# EAGLE design hd6303-mb-ram-rom-x1 (EAGLE 9.2.2)

## Sheet 1 of 2
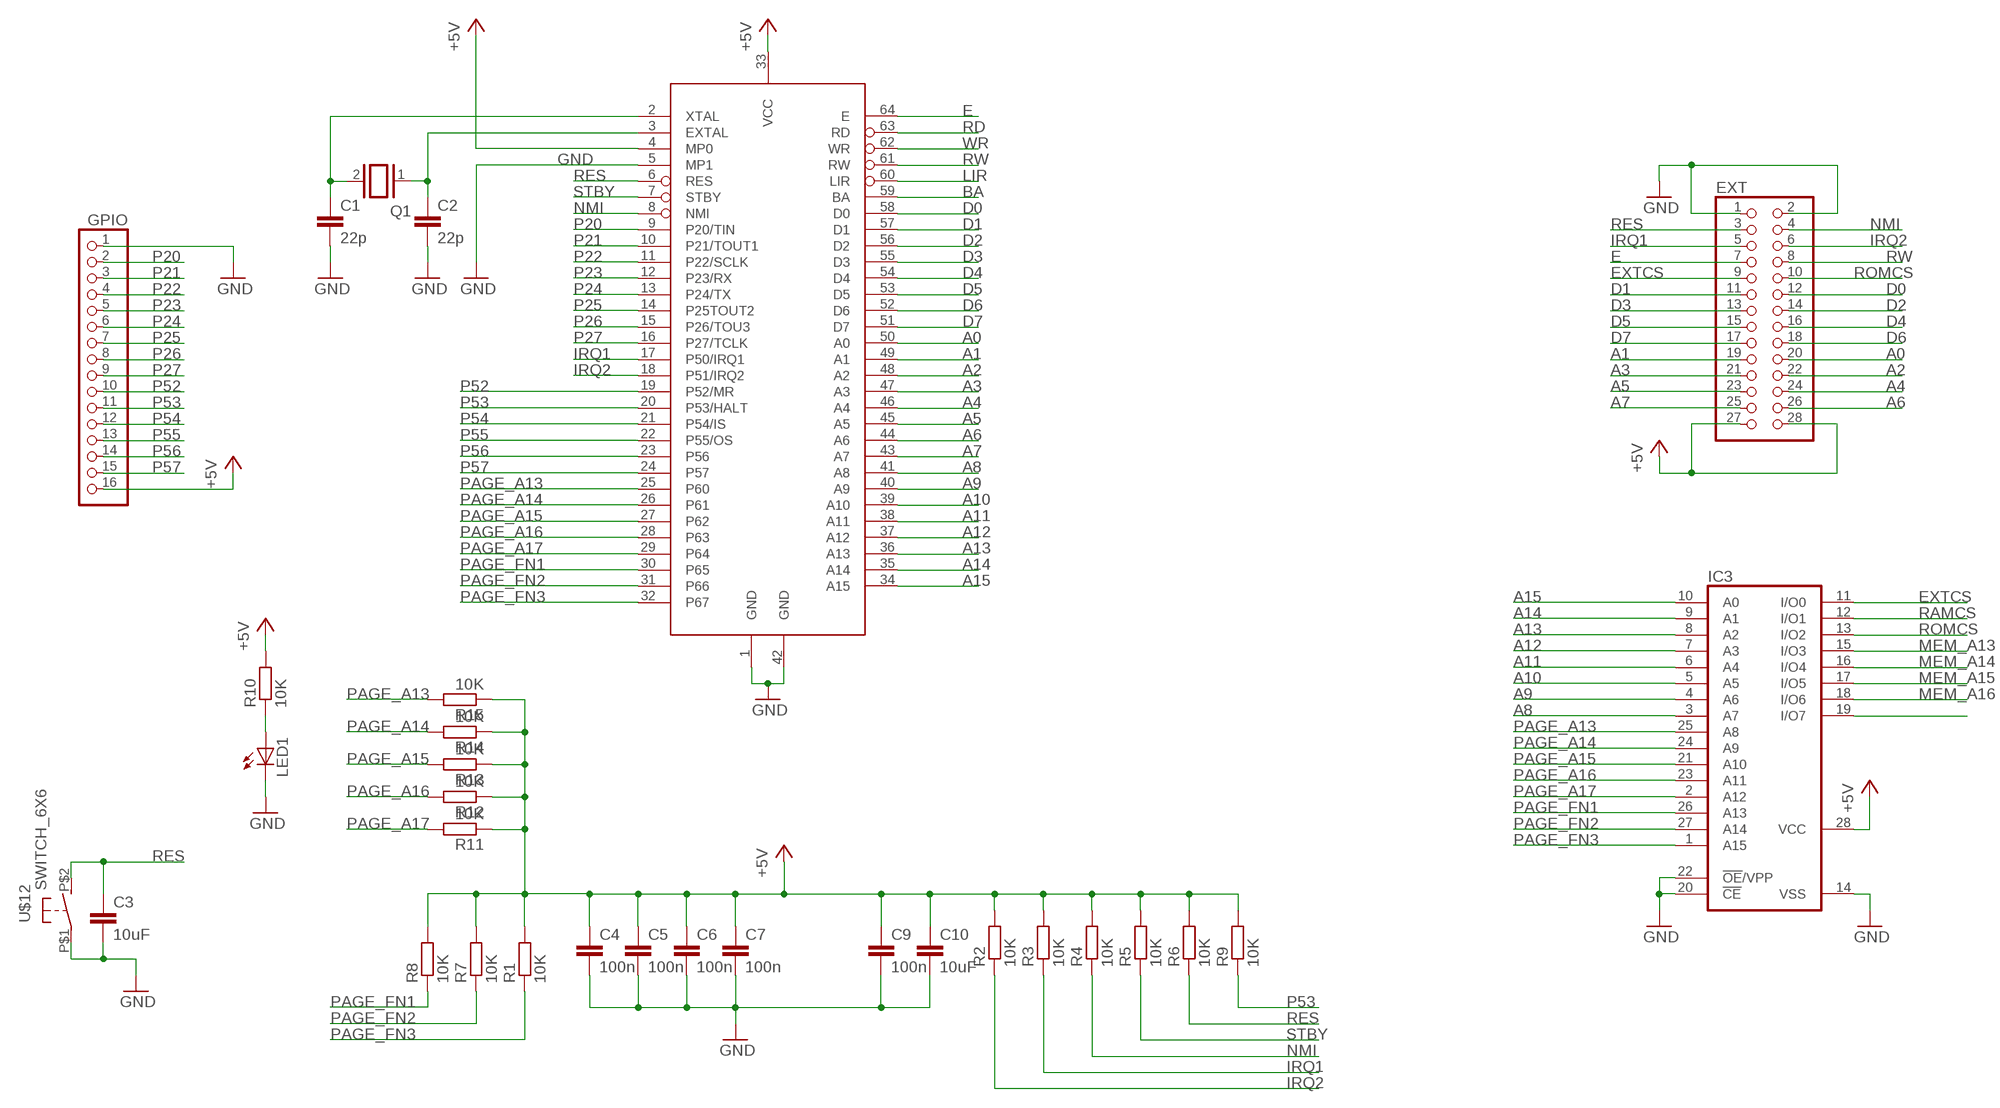
[diagram p0: schematic, sheet 1]

### Parts
C1  22p  C-EUC0603  [C0603]
C2  22p  C-EUC0603  [C0603]
C3  10uF  C-EUC0805  [C0805]
C4  100n  C-EUC0603  [C0603]
C5  100n  C-EUC0603  [C0603]
C6  100n  C-EUC0603  [C0603]
C7  100n  C-EUC0603  [C0603]
C9  100n  C-EUC0603  [C0603]
C10  10uF  C-EUC0805  [C0805]
EXT  PINHD-2X14  [2X14]
GPIO  PINHD-1X16  [1X16]
IC3  27512G  [DIL28-6]
LED1  LED5MM  [LED5MM]
Q1  XTAL/S  [QS]
R1  10K  R-EU_R0603  [R0603]
R2  10K  R-EU_R0603  [R0603]
R3  10K  R-EU_R0603  [R0603]
R4  10K  R-EU_R0603  [R0603]
R5  10K  R-EU_R0603  [R0603]
R6  10K  R-EU_R0603  [R0603]
R7  10K  R-EU_R0603  [R0603]
R8  10K  R-EU_R0603  [R0603]
R9  10K  R-EU_R0603  [R0603]
R10  10K  R-EU_R0603  [R0603]
R11  10K  R-EU_R0603  [R0603]
R12  10K  R-EU_R0603  [R0603]
R13  10K  R-EU_R0603  [R0603]
R14  10K  R-EU_R0603  [R0603]
R15  10K  R-EU_R0603  [R0603]
U$1  HD6303YCP  [DP-64S]
U$12  SWITCH_6X6  [SWITCH_6X6]

### Nets
+5V: C4.1 C5.1 C6.1 C7.1 C9.1 C10.1 EXT.27 EXT.28 GPIO.16 IC3.28(VCC) R1.2 R2.2 R3.2 R4.2 R5.2 R6.2 R7.2 R8.2 R9.2 R10.2 R11.1 R12.1 R13.1 R14.1 R15.1 U$1.4(MP0) U$1.33(VCC) ; also sheet 2
A0: EXT.20 U$1.50(A0) ; also sheet 2
A1: EXT.19 U$1.49(A1) ; also sheet 2
A2: EXT.22 U$1.48(A2) ; also sheet 2
A3: EXT.21 U$1.47(A3) ; also sheet 2
A4: EXT.24 U$1.46(A4) ; also sheet 2
A5: EXT.23 U$1.45(A5) ; also sheet 2
A6: EXT.26 U$1.44(A6) ; also sheet 2
A7: EXT.25 U$1.43(A7) ; also sheet 2
A8: IC3.3(A7) U$1.41(A8) ; also sheet 2
A9: IC3.4(A6) U$1.40(A9) ; also sheet 2
A10: IC3.5(A5) U$1.39(A10) ; also sheet 2
A11: IC3.6(A4) U$1.38(A11) ; also sheet 2
A12: IC3.7(A3) U$1.37(A12) ; also sheet 2
A13: IC3.8(A2) U$1.36(A13)
A14: IC3.9(A1) U$1.35(A14)
A15: IC3.10(A0) U$1.34(A15)
BA: U$1.59(BA)
D0: EXT.12 U$1.58(D0) ; also sheet 2
D1: EXT.11 U$1.57(D1) ; also sheet 2
D2: EXT.14 U$1.56(D2) ; also sheet 2
D3: EXT.13 U$1.55(D3) ; also sheet 2
D4: EXT.16 U$1.54(D4) ; also sheet 2
D5: EXT.15 U$1.53(D5) ; also sheet 2
D6: EXT.18 U$1.52(D6) ; also sheet 2
D7: EXT.17 U$1.51(D7) ; also sheet 2
E: EXT.7 U$1.64(E)
EXTCS: EXT.9 IC3.11(I/O0)
GND: C1.2 C2.2 C3.2 C4.2 C5.2 C6.2 C7.2 C9.2 C10.2 EXT.1 EXT.2 GPIO.1 IC3.14(VSS) IC3.20(!CE) IC3.22(!OE!/VPP) LED1.K(C) U$1.1(GND) U$1.5(MP1) U$1.42(GND) U$12.P$1(P) ; also sheet 2
IRQ1: EXT.5 R3.1 U$1.17(P50/IRQ1)
IRQ2: EXT.6 R2.1 U$1.18(P51/IRQ2)
LIR: U$1.60(LIR)
MEM_A13: IC3.15(I/O3) ; also sheet 2
MEM_A14: IC3.16(I/O4) ; also sheet 2
MEM_A15: IC3.17(I/O5) ; also sheet 2
MEM_A16: IC3.18(I/O6) ; also sheet 2
N$1: LED1.A R10.1
N$5: C1.1 Q1.2 U$1.2(XTAL)
N$25: IC3.19(I/O7)
N$30: C2.1 Q1.1 U$1.3(EXTAL)
NMI: EXT.4 R4.1 U$1.8(NMI)
P20: GPIO.2 U$1.9(P20/TIN)
P21: GPIO.3 U$1.10(P21/TOUT1)
P22: GPIO.4 U$1.11(P22/SCLK)
P23: GPIO.5 U$1.12(P23/RX)
P24: GPIO.6 U$1.13(P24/TX)
P25: GPIO.7 U$1.14(P25TOUT2)
P26: GPIO.8 U$1.15(P26/TOU3)
P27: GPIO.9 U$1.16(P27/TCLK)
P52: GPIO.10 U$1.19(P52/MR)
P53: GPIO.11 R9.1 U$1.20(P53/HALT)
P54: GPIO.12 U$1.21(P54/IS)
P55: GPIO.13 U$1.22(P55/OS)
P56: GPIO.14 U$1.23(P56)
P57: GPIO.15 U$1.24(P57)
PAGE_A13: IC3.25(A8) R15.2 U$1.25(P60)
PAGE_A14: IC3.24(A9) R14.2 U$1.26(P61)
PAGE_A15: IC3.21(A10) R13.2 U$1.27(P62)
PAGE_A16: IC3.23(A11) R12.2 U$1.28(P63)
PAGE_A17: IC3.2(A12) R11.2 U$1.29(P64)
PAGE_FN1: IC3.26(A13) R8.1 U$1.30(P65)
PAGE_FN2: IC3.27(A14) R7.1 U$1.31(P66)
PAGE_FN3: IC3.1(A15) R1.1 U$1.32(P67)
RAMCS: IC3.12(I/O1) ; also sheet 2
RD: U$1.63(RD) ; also sheet 2
RES: C3.1 EXT.3 R6.1 U$1.6(RES) U$12.P$2(S)
ROMCS: EXT.10 IC3.13(I/O2) ; also sheet 2
RW: EXT.8 U$1.61(RW)
STBY: R5.1 U$1.7(STBY)
WR: U$1.62(WR) ; also sheet 2

## Sheet 2 of 2
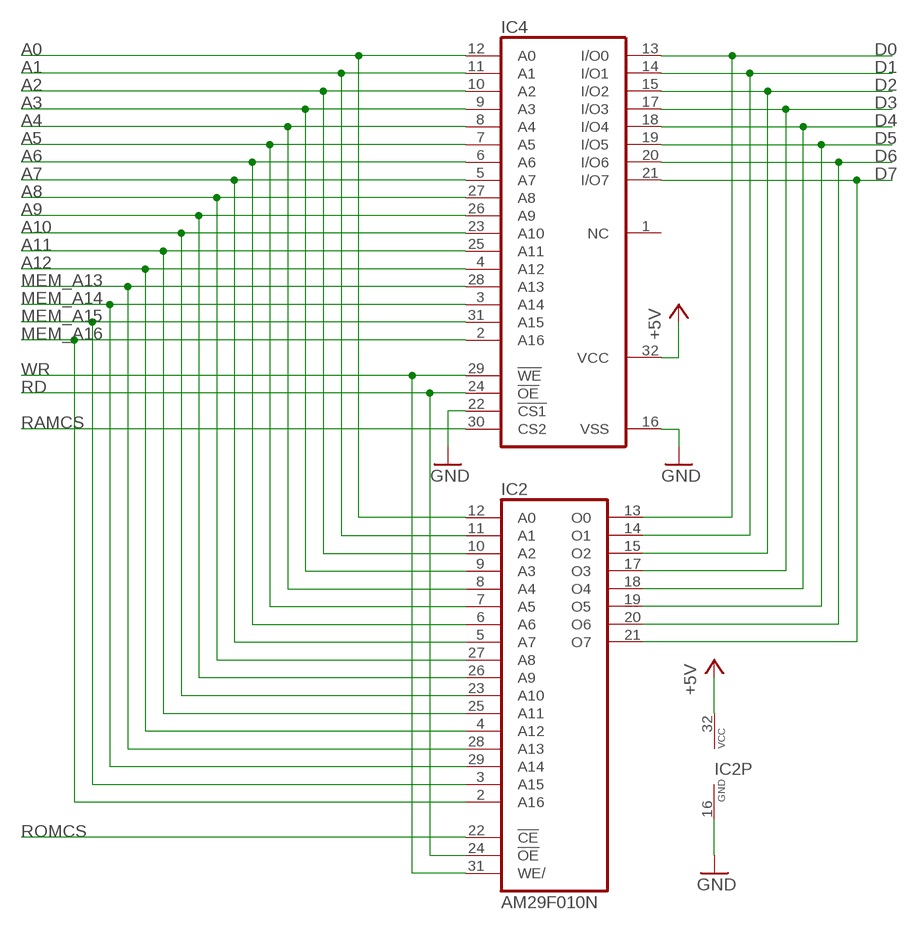
[diagram p1: schematic, sheet 2]

### Parts
IC2  AM29F010N  [DIP32]
IC4  628128P  [DIL32]

### Nets
+5V: IC2.32(VCC) IC4.32(VCC) ; also sheet 1
A0: IC2.12(A0) IC4.12(A0) ; also sheet 1
A1: IC2.11(A1) IC4.11(A1) ; also sheet 1
A2: IC2.10(A2) IC4.10(A2) ; also sheet 1
A3: IC2.9(A3) IC4.9(A3) ; also sheet 1
A4: IC2.8(A4) IC4.8(A4) ; also sheet 1
A5: IC2.7(A5) IC4.7(A5) ; also sheet 1
A6: IC2.6(A6) IC4.6(A6) ; also sheet 1
A7: IC2.5(A7) IC4.5(A7) ; also sheet 1
A8: IC2.27(A8) IC4.27(A8) ; also sheet 1
A9: IC2.26(A9) IC4.26(A9) ; also sheet 1
A10: IC2.23(A10) IC4.23(A10) ; also sheet 1
A11: IC2.25(A11) IC4.25(A11) ; also sheet 1
A12: IC2.4(A12) IC4.4(A12) ; also sheet 1
D0: IC2.13(O0) IC4.13(I/O0) ; also sheet 1
D1: IC2.14(O1) IC4.14(I/O1) ; also sheet 1
D2: IC2.15(O2) IC4.15(I/O2) ; also sheet 1
D3: IC2.17(O3) IC4.17(I/O3) ; also sheet 1
D4: IC2.18(O4) IC4.18(I/O4) ; also sheet 1
D5: IC2.19(O5) IC4.19(I/O5) ; also sheet 1
D6: IC2.20(O6) IC4.20(I/O6) ; also sheet 1
D7: IC2.21(O7) IC4.21(I/O7) ; also sheet 1
GND: IC2.16(GND) IC4.16(VSS) IC4.22(!CS1) ; also sheet 1
MEM_A13: IC2.28(A13) IC4.28(A13) ; also sheet 1
MEM_A14: IC2.29(A14) IC4.3(A14) ; also sheet 1
MEM_A15: IC2.3(A15) IC4.31(A15) ; also sheet 1
MEM_A16: IC2.2(A16) IC4.2(A16) ; also sheet 1
RAMCS: IC4.30(CS2) ; also sheet 1
RD: IC2.24(!OE) IC4.24(!OE) ; also sheet 1
ROMCS: IC2.22(!CE) ; also sheet 1
WR: IC2.31(WE/) IC4.29(!WE) ; also sheet 1
Unconnected: IC2.1(NC) IC2.30(NC) IC4.1(NC)

## Library data of the parts
C1 = rcl:C-EU: CAPACITOR, European symbol; SPICEPREFIX: C
C2 C4-C7 C9 = rcl:C-EU: CAPACITOR, European symbol
C3 C10 = resistor:C-EU: CAPACITOR, European symbol
EXT = pinhead:PINHD-2X14: PIN HEADER
GPIO = pinhead:PINHD-1X16: PIN HEADER
IC2 = am29-memory:AM29F010*: 1-Megabit FLASH MEMORY (128 K x 8 bit) 5 V-only
IC3 = memory-hitachi:27512G: MEMORY; OC_FARNELL: unknown; OC_NEWARK: unknown
IC4 = memory-hitachi:628128P: MEMORY; OC_FARNELL: unknown; OC_NEWARK: unknown
LED1 = led:LED: LED OSRAM: - CHIPLED LG R971, LG N971, LY N971, LG Q971, LY Q971, LO R971, LY R971 LH N974, LH R974 LS Q976, LO Q976, LY Q976 LO Q996 - Hyper CHIPLED LW Q18S LB Q993, LB Q99A, LB R99A - SideLED LS A670, LO A670, LY A670, LG A670, LP A670 LB A673, LV A673, LT A673, LW A673 LH A674 LY A675 LS A676, LA A676, LO A676, LY A676, LW A676 LS A679, LY A679, LG A679 - Hyper Micro SIDELED® LS Y876, LA Y876, LO Y876, LY Y876 LT Y87S - SmartLED LW L88C, LW L88S LB L89C, LB L89S, LG L890 LS L89K, LO L89K, LY L89K LS L896, LA L896, LO L896, LY L896 - TOPLED LS T670, LO T670, LY T670, LG T670, LP T670 LSG T670, LSP T670, LSY T670, LOP T670, LYG T670 LG T671, LOG T671, LSG T671 LB T673, LV T673, LT T673, LW T673 LH T674 LS T676, LA T676, LO T676, LY T676, LB T676, LH T676, LSB T676, LW T676 LB T67C, LV T67C, LT T67C, LS T67K, LO T67K, LY T67K, LW E67C LS E67B, LA E67B, LO E67B, LY E67B, LB E67C, LV E67C, LT E67C LW T67C LS T679, LY T679, LG T679 LS T770, LO T770, LY T770, LG T770, LP T770 LB T773, LV T773, LT T773, LW T773 LH T774 LS E675, LA E675, LY E675, LS T675 LS T776, LA T776, LO T776, LY T776, LB T776 LHGB T686 LT T68C, LB T68C - Hyper Mini TOPLED® LB M676 - Mini TOPLED Santana® LG M470 LS M47K, LO M47K, LY M47K Source: http://www.osram.convergy.de LUXEON: - LUMILED® LXK2-PW12-R00, LXK2-PW12-S00, LXK2-PW14-U00, LXK2-PW14-V00 LXK2-PM12-R00, LXK2-PM12-S00, LXK2-PM14-U00 LXK2-PE12-Q00, LXK2-PE12-R00, LXK2-PE12-S00, LXK2-PE14-T00, LXK2-PE14-U00 LXK2-PB12-K00, LXK2-PB12-L00, LXK2-PB12-M00, LXK2-PB14-N00, LXK2-PB14-P00, LXK2-PB14-Q00 LXK2-PR12-L00, LXK2-PR12-M00, LXK2-PR14-Q00, LXK2-PR14-R00 LXK2-PD12-Q00, LXK2-PD12-R00, LXK2-PD12-S00 LXK2-PH12-R00, LXK2-PH12-S00 LXK2-PL12-P00, LXK2-PL12-Q00, LXK2-PL12-R00 Source: www.luxeon.com KINGBRIGHT: KA-3528ASYC Source: www.kingbright.com
Q1 = special:XTAL/S: CRYSTAL
R1-R15 = resistor:R-EU_: RESISTOR, European symbol
U$1 = addons-lib:HD6303YCP
U$12 = mouse_enc:SWITCH_6X6

## Board
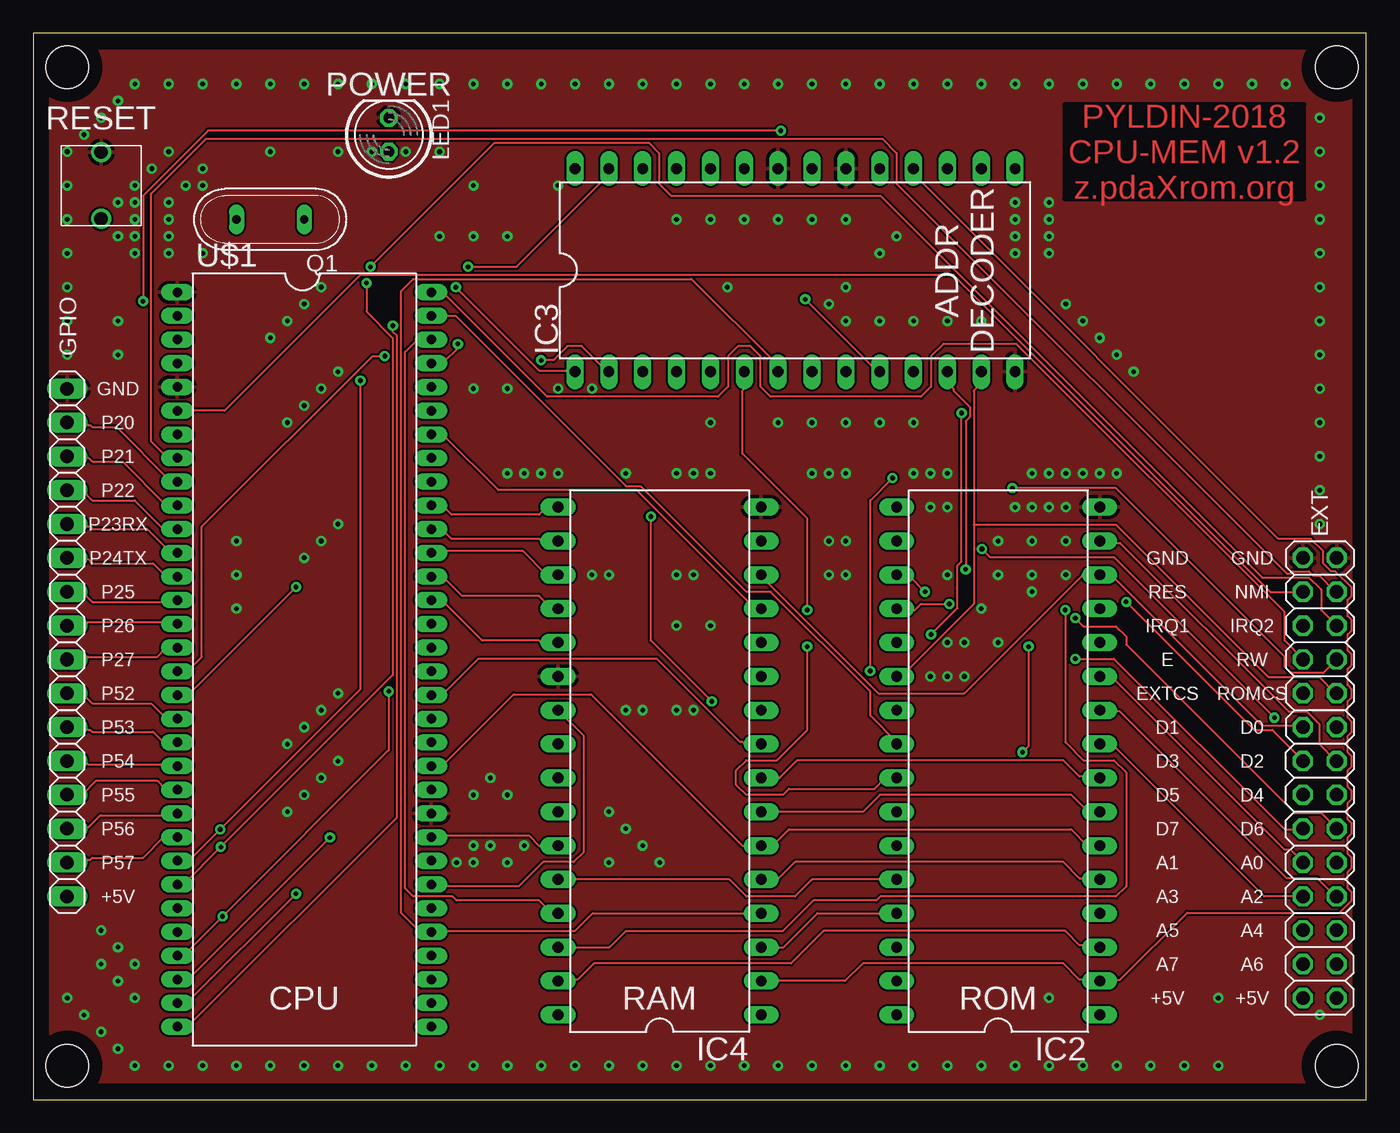
[diagram p2: board, top side]
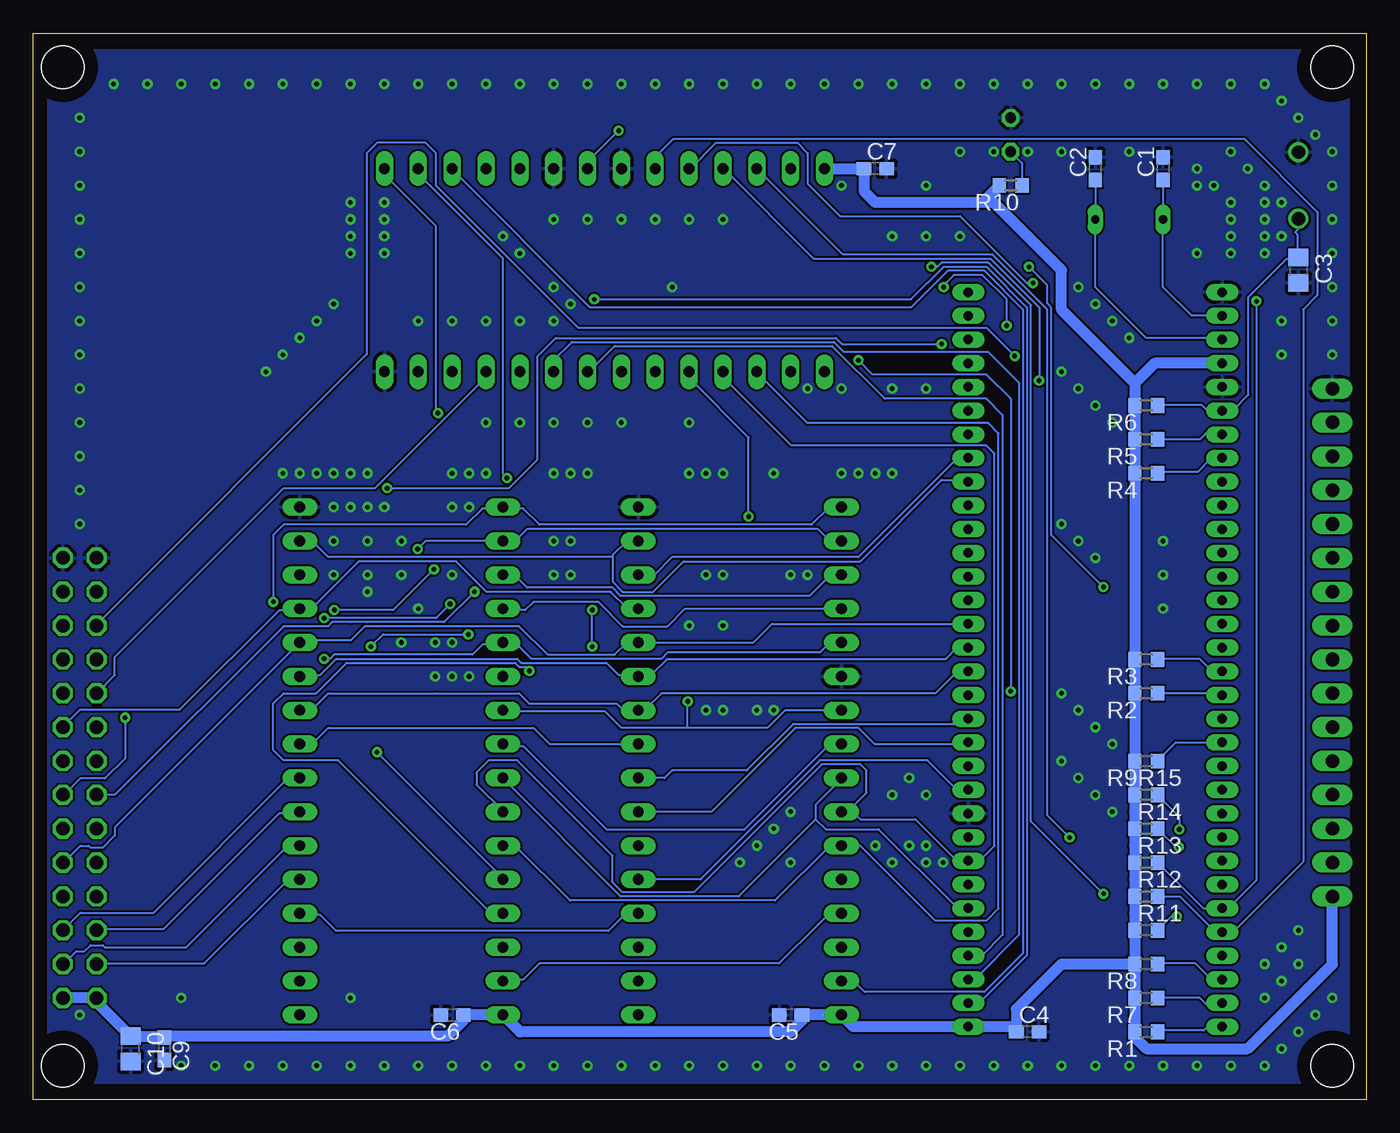
[diagram p3: board, bottom side, seen from below]

Size 100 x 80 mm. Coordinates in mm from the lower left corner, seen from the top.
Outline: 0,0 100,0 100,80 0,80 0,0
Copper layers (1*16): Top 0.035mm / dielectric 1.5mm / Bottom 0.035mm
Design rules "default *": minimum track width 6mil, minimum drill 0.35mm, track to track 6mil, track to pad 6mil, pad to pad 6mil, via to via 6mil, smd to smd 6mil, copper to edge 40mil, drill to drill 6mil, minimum pad ring 10mil, minimum via ring 8mil, stop-mask expansion 4mil, vias tented up to drill 23mil, thermal gap 10mil
Holes 3.2 mm at 2.54,77.47 2.54,2.54 97.79,2.54 97.79,77.47

### Footprints (pad centres in the part's own frame; a part is rotated, then mirrored left to right if it is on the bottom)
C0603 = smd 1.1 x 1: 1 -0.85,0; 2 0.85,0
C0805 = smd 1.3 x 1.5: 1 -0.95,0; 2 0.95,0
2X14 = drill 1.016 octagon: 1 -16.51,-1.27; 2 -16.51,1.27; 3 -13.97,-1.27; 4 -13.97,1.27; 5 -11.43,-1.27; 6 -11.43,1.27; 7 -8.89,-1.27; 8 -8.89,1.27; 9 -6.35,-1.27; 10 -6.35,1.27; 11 -3.81,-1.27; 12 -3.81,1.27; 13 -1.27,-1.27; 14 -1.27,1.27; 15 1.27,-1.27; 16 1.27,1.27; 17 3.81,-1.27; 18 3.81,1.27; 19 6.35,-1.27; 20 6.35,1.27; 21 8.89,-1.27; 22 8.89,1.27; 23 11.43,-1.27; 24 11.43,1.27; 25 13.97,-1.27; 26 13.97,1.27; 27 16.51,-1.27; 28 16.51,1.27
1X16 = drill 1.016 long: 1 -19.05,0; 2 -16.51,0; 3 -13.97,0; 4 -11.43,0; 5 -8.89,0; 6 -6.35,0; 7 -3.81,0; 8 -1.27,0; 9 1.27,0; 10 3.81,0; 11 6.35,0; 12 8.89,0; 13 11.43,0; 14 13.97,0; 15 16.51,0; 16 19.05,0
DIP32 = drill 0.813 long: 1 -19.05,-7.62; 2 -16.51,-7.62; 3 -13.97,-7.62; 4 -11.43,-7.62; 5 -8.89,-7.62; 6 -6.35,-7.62; 7 -3.81,-7.62; 8 -1.27,-7.62; 9 1.27,-7.62; 10 3.81,-7.62; 11 6.35,-7.62; 12 8.89,-7.62; 13 11.43,-7.62; 14 13.97,-7.62; 15 16.51,-7.62; 16 19.05,-7.62; 17 19.05,7.62; 18 16.51,7.62; 19 13.97,7.62; 20 11.43,7.62; 21 8.89,7.62; 22 6.35,7.62; 23 3.81,7.62; 24 1.27,7.62; 25 -1.27,7.62; 26 -3.81,7.62; 27 -6.35,7.62; 28 -8.89,7.62; 29 -11.43,7.62; 30 -13.97,7.62; 31 -16.51,7.62; 32 -19.05,7.62
DIL28-6 = drill 0.813 long: 1 -16.51,-7.62; 2 -13.97,-7.62; 3 -11.43,-7.62; 4 -8.89,-7.62; 5 -6.35,-7.62; 6 -3.81,-7.62; 7 -1.27,-7.62; 8 1.27,-7.62; 9 3.81,-7.62; 10 6.35,-7.62; 11 8.89,-7.62; 12 11.43,-7.62; 13 13.97,-7.62; 14 16.51,-7.62; 15 16.51,7.62; 16 13.97,7.62; 17 11.43,7.62; 18 8.89,7.62; 19 6.35,7.62; 20 3.81,7.62; 21 1.27,7.62; 22 -1.27,7.62; 23 -3.81,7.62; 24 -6.35,7.62; 25 -8.89,7.62; 26 -11.43,7.62; 27 -13.97,7.62; 28 -16.51,7.62
DIL32 = drill 0.813 long: 1 -19.05,-7.62; 2 -16.51,-7.62; 3 -13.97,-7.62; 4 -11.43,-7.62; 5 -8.89,-7.62; 6 -6.35,-7.62; 7 -3.81,-7.62; 8 -1.27,-7.62; 9 1.27,-7.62; 10 3.81,-7.62; 11 6.35,-7.62; 12 8.89,-7.62; 13 11.43,-7.62; 14 13.97,-7.62; 15 16.51,-7.62; 16 19.05,-7.62; 17 19.05,7.62; 18 16.51,7.62; 19 13.97,7.62; 20 11.43,7.62; 21 8.89,7.62; 22 6.35,7.62; 23 3.81,7.62; 24 1.27,7.62; 25 -1.27,7.62; 26 -3.81,7.62; 27 -6.35,7.62; 28 -8.89,7.62; 29 -11.43,7.62; 30 -13.97,7.62; 31 -16.51,7.62; 32 -19.05,7.62
LED5MM = drill 0.813 octagon: A -1.27,0; K 1.27,0
QS = drill 0.61 long: 1 -2.54,0; 2 2.54,0
R0603 = smd 1 x 1.1: 1 -0.85,0; 2 0.85,0
DP-64S = drill 0.711 long: 1 -27.559,-9.525; 2 -25.781,-9.525; 3 -24.003,-9.525; 4 -22.225,-9.525; 5 -20.447,-9.525; 6 -18.669,-9.525; 7 -16.891,-9.525; 8 -15.113,-9.525; 9 -13.335,-9.525; 10 -11.557,-9.525; 11 -9.779,-9.525; 12 -8.001,-9.525; 13 -6.223,-9.525; 14 -4.445,-9.525; 15 -2.667,-9.525; 16 -0.889,-9.525; 17 0.889,-9.525; 18 2.667,-9.525; 19 4.445,-9.525; 20 6.223,-9.525; 21 8.001,-9.525; 22 9.779,-9.525; 23 11.557,-9.525; 24 13.335,-9.525; 25 15.113,-9.525; 26 16.891,-9.525; 27 18.669,-9.525; 28 20.447,-9.525; 29 22.225,-9.525; 30 24.003,-9.525; 31 25.781,-9.525; 32 27.559,-9.525; 33 27.559,9.525; 34 25.781,9.525; 35 24.003,9.525; 36 22.225,9.525; 37 20.447,9.525; 38 18.669,9.525; 39 16.891,9.525; 40 15.113,9.525; 41 13.335,9.525; 42 11.557,9.525; 43 9.779,9.525; 44 8.001,9.525; 45 6.223,9.525; 46 4.445,9.525; 47 2.667,9.525; 48 0.889,9.525; 49 -0.889,9.525; 50 -2.667,9.525; 51 -4.445,9.525; 52 -6.223,9.525; 53 -8.001,9.525; 54 -9.779,9.525; 55 -11.557,9.525; 56 -13.335,9.525; 57 -15.113,9.525; 58 -16.891,9.525; 59 -18.669,9.525; 60 -20.447,9.525; 61 -22.225,9.525; 62 -24.003,9.525; 63 -25.781,9.525; 64 -27.559,9.525
SWITCH_6X6 = drill 1: P$1 -2.5,0; P$2 2.5,0

### Placement (x,y rotation side)
C1  15.24,69.85 90 bottom
C2  20.32,69.85 90 bottom
C3  5.08,62.23 270 bottom
C4  25.4,5.08 0 bottom
C5  43.18,6.35 180 bottom
C6  68.58,6.35 180 bottom
C7  36.83,69.85 0 bottom
C9  90.17,3.81 270 bottom
C10  92.71,3.81 270 bottom
EXT  96.52,24.13 270 top
GPIO  2.54,34.29 270 top
IC2  72.39,25.4 90 top
IC3  57.15,62.23 0 top
IC4  46.99,25.4 90 top
LED1  26.67,72.39 90 top
Q1  17.78,66.04 180 top
R1  16.51,5.08 180 bottom
R2  16.51,30.48 180 bottom
R3  16.51,33.02 180 bottom
R4  16.51,46.99 180 bottom
R5  16.51,49.53 180 bottom
R6  16.51,52.07 180 bottom
R7  16.51,7.62 180 bottom
R8  16.51,10.16 180 bottom
R9  16.51,25.4 180 bottom
R10  26.67,68.58 180 bottom
R11  16.51,12.7 0 bottom
R12  16.51,15.24 0 bottom
R13  16.51,17.78 0 bottom
R14  16.51,20.32 0 bottom
R15  16.51,22.86 0 bottom
U$1  20.32,33.02 270 top
U$12  5.08,68.58 270 top

### Tracks (layer width: path | path; a pad name or v marks a point on that pad's centre or on a via)
+5V
  Bottom 0.152: R11.1 17.36,13.97 | R12.1 17.36,16.51 | R13.1 17.36,19.05 | R14.1 17.36,21.59 | R15.1 17.36,24.13
  Bottom 0.813: U$1.4 15.88,55.24 17.36,53.76 | 17.36,53.76 R6.2 R5.2 R4.2 R3.2 R2.2 R9.2 17.36,24.13 17.36,21.59 17.36,19.05 17.36,16.51 17.36,13.97 R8.2 | R8.2 R7.2 R1.2 17.36,4.66 16.51,3.81 8.89,3.81 2.54,10.16 GPIO.16 | R8.2 22.86,10.16 26.25,6.77 C4.1 26.63,5.46 U$1.33 38.48,5.46 IC4.32 C5.1 42.33,5.93 43.18,5.08 63.5,5.08 IC2.32 C6.1 67.73,5.93 68.9,4.76 90.27,4.76 | IC3.28 C7.1 37.68,68.16 36.83,67.31 28.79,67.31 | 28.79,67.31 27.94,67.31 22.86,62.23 22.86,59.26 17.36,53.76 | 90.27,4.76 C10.1 95.25,7.3 EXT.27 EXT.28 | 90.27,4.76 C9.1 | R10.2 28.79,67.31
A0
  Bottom 0.152: EXT.20 97.69,17.83 96.47,19.05 95.86,19.05 95.71,18.9 94.79,18.9 93.88,19.81 93.88,20.42 IC2.12 79.86,34.44 76.2,34.44 75.13,35.51 63.55,35.51 61.42,33.38 56.39,33.38 55.47,34.29 IC4.12 45.97,34.29 44.58,35.69 U$1.50
A1
  Top 0.152: IC2.11 80.01,31.7 80.92,31.7 93.88,18.75 94.34,18.75 95.25,17.83 EXT.19
  Bottom 0.152: U$1.49 29.87,33.83 30.79,33.83 31.55,33.07 52.43,33.07 53.65,31.85 54.56,31.85 IC4.11 54.71,31.85 56.08,31.85 57,32.77 63.4,32.77 63.7,33.07 77.27,33.07 78.49,31.85 80.01,31.85 IC2.11
A2
  Top 0.152: IC2.10 80.01,29.11 81.53,29.11 94.03,16.61 96.32,16.61 97.69,15.24 EXT.22
  Bottom 0.152: U$1.48 29.87,32 30.79,32 32.31,30.48 52.88,30.48 54.1,29.26 54.56,29.26 IC4.10 54.71,29.26 55.78,29.26 56.24,29.72 62.79,29.72 63.55,30.48 69.85,30.48 77.88,30.48 79.1,29.26 80.01,29.26 IC2.10
A3
  Top 0.152: IC2.9 80.92,26.67 92.35,15.24 EXT.21 | IC4.9 53.34,26.67 53.19,26.82 53.03,26.82 46.79,33.07 33.38,33.07 30.79,30.48 29.87,30.48 U$1.47
  Bottom 0.152: IC2.9 79.1,26.67 77.88,27.89 62.48,27.89 61.27,26.67 IC4.9
A4
  Top 0.152: IC2.8 80.01,24.23 78.49,24.23 77.27,25.45 57.3,25.45 55.98,24.13 IC4.8
  Bottom 0.152: EXT.24 96.47,14.02 90.98,14.02 80.92,24.08 80.01,24.08 IC2.8 | U$1.46 30.23,28.19 42.98,28.19 46.48,24.69 52.07,24.69 52.63,24.13 IC4.8
A5
  Top 0.152: IC2.7 80.01,21.64 79.1,21.64 77.88,22.86 63.5,22.86 62.23,21.59 IC4.7
  Bottom 0.152: IC2.7 80.01,21.49 81.53,21.49 90.22,12.8 95.25,12.8 EXT.23 | U$1.45 29.87,26.67 36.88,26.67 38.1,27.89 42.82,27.89 49.12,21.59 IC4.7
A6
  Top 0.152: U$1.44 29.87,25.15 30.79,25.15 36.04,30.4 41.83,30.4 53.19,19.05 IC4.6 55.47,19.05 56.69,20.27 77.88,20.27 79.1,19.05 IC2.6
  Bottom 0.152: IC2.6 80.92,19.05 88.54,11.43 94.64,11.43 94.79,11.58 95.71,11.58 96.16,11.12 96.77,11.12 97.69,10.21 EXT.26
A7
  Top 0.152: IC2.5 80.01,16.61 78.49,16.61 77.27,17.83 57.15,17.83 55.83,16.51 IC4.5
  Bottom 0.152: IC2.5 80.01,16.46 80.92,16.46 87.17,10.21 95.25,10.21 EXT.25 | U$1.43 29.87,23.32 30.79,23.32 32.92,25.45 41,25.45 49.94,16.51 IC4.5
A8
  Top 0.152: U$1.41 29.87,19.81 37.19,19.81 37.95,19.05 IC4.27
  Bottom 0.152: IC2.27 63.86,19.05 59.74,14.94 44.35,14.94 40.23,19.05 IC4.27 37.95,19.05 32.31,13.41 28.5,13.41 27.58,14.33 27.58,49.99 28.35,50.75 41.91,50.75 45.72,54.56 IC3.3
A9
  Bottom 0.152: 38.41,21.49 37.95,21.03 33.83,21.03 30.79,17.98 29.87,17.98 U$1.40 29.72,17.98 28.96,17.98 27.89,19.05 27.89,48.46 28.5,49.07 43.13,49.07 48.16,54.1 48.16,54.56 IC3.4 | 38.41,21.49 39.32,21.49 IC4.26 38.41,21.49 | 38.41,21.49 38.41,22.1 37.49,23.01 37.49,24.69 37.95,25.15 40.84,25.15 50.44,15.54 55.78,15.54 56.54,16.31 56.54,18.29 63.7,25.45 65.84,25.45 66.75,24.54 66.75,23.62 64.77,21.64 IC2.26
A10  (via drill 0.35)
  Top 0.152: U$1.39 29.87,16 36.42,16 38.25,17.83 40.54,17.83 41.3,18.59 41.3,27.28 IC4.23 | v46.33,43.74 46.33,34.44 v50.9,29.87
  Bottom 0.152: 50.9,27.89 55.88,27.89 57.1,29.11 64.77,29.11 IC2.23 | v46.33,43.74 46.33,49.68 50.75,54.1 50.75,54.56 IC3.5 | 50.9,27.89 v50.9,29.87 | 50.9,27.89 44.91,27.89 43.59,29.21 IC4.23
A11  (via drill 0.35)
  Top 0.152: IC3.6 53.34,53.34 53.19,53.19 53.19,48.46 58.06,43.59 v58.06,36.73 | v58.06,33.98 58.06,27.74 55.78,25.45 53.49,25.45 52.73,24.69 52.73,23.62 53.49,22.86 56.24,22.86 56.69,23.32 63.09,23.32 63.91,24.13 IC2.25
  Bottom 0.152: 41.3,21.03 40.54,20.27 36.58,20.27 30.79,14.48 29.87,14.48 U$1.38 | 41.3,21.03 41.3,22.1 39.32,24.08 IC4.25 | 41.3,21.03 47.09,15.24 55.93,15.24 64.77,24.08 IC2.25 | v58.06,33.98 v58.06,36.73
A12
  Top 0.152: 30.79,12.65 29.87,12.65 U$1.37 29.72,12.65 | 29.72,12.65 28.96,12.65 27.58,14.02 27.58,60.66 28.5,61.57 49.38,61.57 55.78,55.17 55.78,54.71 IC3.7 | 29.72,12.65 40.64,12.65 41.96,13.97 IC4.4
  Bottom 0.152: IC2.4 80.01,13.87 78.49,13.87 77.27,12.65 56.84,12.65 55.63,13.87 54.71,13.87 IC4.4
A13
  Bottom 0.152: U$1.36 29.72,10.82 28.8,10.82 27.28,12.34 27.28,51.36 28.5,52.58 36.12,52.58 40.08,56.54 56.39,56.54 58.37,54.56 IC3.8
A14
  Bottom 0.152: IC3.9 60.96,55.47 59.59,56.84 39.93,56.84 39.17,56.08 28.35,56.08 26.06,53.8 26.06,12.34 29.26,9.14 29.72,9.14 U$1.35
A15  (via drill 0.35)
  Top 0.152: v57.91,60.05 63.4,54.56 IC3.10
  Bottom 0.152: v57.91,60.05 34.14,60.05 31.7,62.48 28.5,62.48 25.45,59.44 25.45,10.82 28.96,7.32 29.72,7.32 U$1.34
D0
  Top 0.152: U$1.58 29.87,49.84 30.79,49.84 34.9,45.72 45.26,45.72 54.1,36.88 54.56,36.88 IC4.13
  Bottom 0.152: EXT.12 96.47,29.26 89,29.26 81.53,36.73 80.01,36.73 IC2.13 80.01,36.88 79.1,36.88 75.59,40.39 68.28,40.39 65.99,38.1 56.69,38.1 55.47,36.88 54.71,36.88 IC4.13
D1
  Top 0.152: 80.01,39.32 80.92,39.32 92.2,28.04 95.25,28.04 EXT.11 | 80.01,39.32 IC2.14 | IC4.14 54.56,39.32 63.4,30.48 69.85,30.48 78.69,39.32 80.01,39.32
  Bottom 0.152: U$1.57 29.87,48.01 30.79,48.01 38.1,40.69 52.07,40.69 53.39,39.37 IC4.14
D2
  Top 0.152: IC2.15 80.16,41.76 81.53,41.76 94.18,29.11 95.56,29.11 96.47,28.19 96.47,26.67 97.69,25.45 EXT.14
  Bottom 0.152: 56.54,40.69 56.54,40.84 55.47,41.91 IC4.15 | 56.54,40.69 56.54,38.86 55.78,38.1 53.49,38.1 51.21,40.39 37.95,40.39 31.85,46.48 29.87,46.48 U$1.56 | IC2.15 79.1,41.91 77.88,40.69 56.54,40.69
D3  (via drill 0.35)
  Top 0.152: U$1.55 29.87,44.5 30.79,44.5 31.39,43.89 37.95,43.89 38.41,44.35 39.32,44.35 IC4.17 | v81.99,37.34 91.59,27.74 92.96,27.74 95.25,25.45 EXT.13
  Bottom 0.152: 64.77,44.35 63.25,44.35 62.03,43.13 41.6,43.13 40.39,44.35 39.47,44.35 IC4.17 | v81.99,37.34 81.99,42.37 81.23,43.13 67.51,43.13 66.29,44.35 64.77,44.35 | 64.77,44.35 IC2.17
D4  (via drill 0.35)
  Top 0.152: IC4.18 38.1,41.91 37.95,42.06 31.39,42.06 30.79,42.67 29.87,42.67 U$1.54 | v93.12,28.65 81.08,40.69 71.78,40.69 v71.17,41.3
  Bottom 0.152: IC4.18 40.23,41.91 41.15,42.82 62.94,42.82 63.86,41.91 IC2.18 70.56,41.91 v71.17,41.3 | v93.12,28.65 93.12,25.6 94.64,24.08 96.47,24.08 97.69,22.86 EXT.16
D5  (via drill 0.35)
  Top 0.152: U$1.53 29.87,41.15 36.73,41.15 38.41,39.47 39.32,39.47 IC4.19 | v66.9,38.1 65.68,39.32 64.77,39.32 IC2.19
  Bottom 0.152: IC2.19 64.77,39.32 63.86,39.32 62.94,38.41 56.54,38.41 55.93,37.8 41.76,37.8 40.23,39.32 39.47,39.32 IC4.19 | EXT.15 93.88,22.86 81.23,35.51 77.88,35.51 77.57,35.81 76.2,35.81 74.93,35.81 | 74.93,35.81 69.19,35.81 v66.9,38.1 | 74.93,35.81 | 74.93,35.81
D6  (via drill 0.35)
  Top 0.152: U$1.52 29.87,39.17 30.79,39.17 32.16,37.8 37.95,37.8 38.86,36.88 39.32,36.88 IC4.20 | EXT.18 96.62,21.49 94.64,21.49 81.99,34.14 81.99,34.75 81.23,35.51 78.79,35.51 v78.18,36.12 | v68.73,37.19 66.6,37.19 66.14,36.73 64.77,36.73 IC2.20
  Bottom 0.152: IC2.20 64.77,36.73 63.09,36.73 62.48,37.34 57.61,37.34 55.78,35.51 52.43,35.51 51.1,36.83 IC4.20 | v78.18,36.12 69.8,36.12 v68.73,37.19
D7  (via drill 0.35)
  Top 0.152: IC4.21 38.1,34.29 37.95,34.44 33.68,34.44 30.79,37.34 29.87,37.34 U$1.51 | v78.18,33.07 81.08,33.07 93.88,20.27 95.25,20.27 EXT.17
  Bottom 0.152: IC4.21 40.23,34.29 41,33.53 52.43,33.53 52.88,33.07 62.64,33.07 63.86,34.29 IC2.21 64.92,34.14 66.29,34.14 67.06,33.38 77.42,33.38 77.72,33.07 v78.18,33.07
E
  Top 0.152: U$1.64 29.87,60.5 30.79,60.5 38.56,52.73 51.36,52.73 52.12,53.49 52.12,55.78 52.88,56.54 53.8,56.54 54.56,55.78 54.56,53.49 55.32,52.73 66.6,52.73 67.36,53.49 67.36,55.78 68.28,56.69 73.76,56.69 93.88,36.58 93.88,34.44 95.25,33.07 EXT.7
EXTCS
  Bottom 0.152: EXT.9 93.88,31.85 93.88,33.22 81.23,45.87 74.37,45.87 66.14,54.1 66.14,54.56 IC3.11
GND  (via drill 0.35)
  other vias: 33.02,68.58 30.48,64.77 33.02,64.77 35.56,64.77 48.26,66.04 39.37,68.58 50.8,66.04 53.34,66.04 55.88,66.04 58.42,66.04 60.96,66.04 60.96,58.42 63.5,58.42 66.04,58.42 68.58,58.42 66.04,50.8 63.5,50.8 60.96,50.8 58.42,50.8 55.88,50.8 50.8,50.8 64.77,64.77 63.5,63.5 60.96,60.96 59.69,59.69 39.37,53.34 41.91,53.34 52.07,60.96 41.91,39.37 43.18,39.37 48.26,39.37 49.53,39.37 44.45,29.21 45.72,29.21 48.26,29.21 49.53,29.21 59.69,41.91 60.96,41.91 59.69,39.37 60.96,39.37 67.31,31.75 68.58,31.75 69.85,31.75 68.58,34.29 69.85,34.29 72.39,34.29 72.39,39.37 74.93,38.1 74.93,39.37 77.47,39.37 74.93,41.91 77.47,41.91 72.39,41.91 31.75,17.78 33.02,17.78 33.02,19.05 34.29,19.05 35.56,17.78 36.83,19.05 43.18,17.78 43.18,21.59 44.45,20.32 45.72,19.05 46.99,17.78 19.05,21.59 20.32,22.86 21.59,24.13 22.86,25.4 19.05,26.67 20.32,27.94 21.59,29.21 22.86,30.48 15.24,36.83 20.32,40.64 21.59,41.91 22.86,43.18 19.05,50.8 20.32,52.07 21.59,53.34 22.86,54.61 96.52,6.35 88.9,7.62 88.9,2.54 86.36,2.54 83.82,2.54 81.28,2.54 78.74,2.54 76.2,7.62 76.2,2.54 73.66,2.54 71.12,2.54 68.58,2.54 66.04,2.54 63.5,2.54 60.96,2.54 58.42,2.54 55.88,2.54 53.34,2.54 50.8,2.54 48.26,2.54 45.72,2.54 43.18,2.54 40.64,2.54 38.1,2.54 35.56,2.54 33.02,2.54 30.48,2.54 27.94,2.54 2.54,7.62 5.08,5.08 7.62,2.54 10.16,2.54 12.7,2.54 15.24,2.54 17.78,2.54 20.32,2.54 22.86,2.54 25.4,2.54 2.54,55.88 2.54,58.42 2.54,60.96 2.54,63.5 2.54,66.04 2.54,68.58 2.54,71.12 5.08,73.66 7.62,76.2 10.16,76.2 12.7,76.2 15.24,76.2 17.78,76.2 20.32,76.2 22.86,76.2 25.4,76.2 27.94,76.2 30.48,76.2 33.02,76.2 35.56,76.2 38.1,76.2 40.64,76.2 43.18,76.2 45.72,76.2 48.26,76.2 50.8,76.2 53.34,76.2 55.88,76.2 58.42,76.2 60.96,76.2 63.5,76.2 66.04,76.2 68.58,76.2 71.12,76.2 73.66,76.2 76.2,76.2 78.74,76.2 81.28,76.2 83.82,76.2 86.36,76.2 88.9,76.2 91.44,76.2 93.98,76.2 96.52,73.66 96.52,71.12 96.52,68.58 96.52,66.04 96.52,63.5 96.52,60.96 96.52,58.42 96.52,55.88 96.52,53.34 96.52,50.8 96.52,48.26 96.52,45.72 96.52,43.18 6.35,55.88 6.35,58.42 7.62,63.5 7.62,66.04 7.62,68.58 10.16,71.12 10.16,63.5 10.16,66.04 12.7,68.58 17.78,71.12 22.86,71.12 25.4,71.12 27.94,71.12 30.48,71.12 12.7,63.5 17.78,57.15 19.05,58.42 20.32,59.69 21.59,60.96 5.08,12.7 6.35,11.43 5.08,10.16 7.62,10.16 6.35,8.89 7.62,7.62 3.81,6.35 6.35,3.81 6.35,74.93 3.81,72.39 35.56,46.99 36.83,46.99 38.1,46.99 39.37,46.99 44.45,46.99 48.26,46.99 49.53,46.99 50.8,46.99 58.42,46.99 59.69,46.99 60.96,46.99 66.04,46.99 67.31,46.99 68.58,46.99 74.93,46.99 76.2,46.99 77.47,46.99 78.74,46.99 80.01,46.99 81.28,46.99 71.12,58.42 73.66,63.5 73.66,64.77 73.66,66.04 73.66,67.31 76.2,67.31 76.2,66.04 76.2,64.77 76.2,63.5 77.47,59.69 78.74,58.42 80.01,57.15 81.28,55.88 82.55,54.61 67.31,44.45 68.58,44.45 73.66,44.45 74.93,44.45 76.2,44.45 77.47,44.45 6.35,67.31 6.35,64.77 7.62,64.77 7.62,67.31 8.89,69.85 10.16,67.31 11.43,68.58 12.7,69.85 10.16,64.77 34.29,24.13 33.02,22.86 35.56,22.86 68.58,39.37 71.12,36.83 35.56,53.34 33.02,53.34 15.24,41.91 15.24,39.37 50.8,35.56 48.26,35.56
  pour Top: 1.27,78.74 99.06,78.74 99.06,1.27 1.27,1.27
  pour Bottom: 1.27,78.74 99.06,78.74 99.06,1.27 1.27,1.27
IRQ1  (via drill 0.35)
  Top 0.152: v26.36,55.78 25.45,55.78 12.65,42.98 12.65,33.22 11.58,32.16 10.82,32.16 U$1.17
  Bottom 0.152: R3.1 15.54,33.07 12.5,33.07 11.58,32.16 10.82,32.16 U$1.17 | v26.36,55.78 28.47,57.89 59.11,57.89 69.8,68.58 69.8,71.02 70.56,71.78 74.22,71.78 74.98,71.02 74.98,55.93 95.25,35.66 EXT.5
IRQ2  (via drill 0.35)
  Top 0.152: EXT.6 96.62,36.73 96.62,38.25 95.71,39.17 92.2,39.17 63.55,67.82 47.85,67.82 46.94,68.73 46.94,71.02 46.18,71.78 34.59,71.78 v25.3,62.48 | v19.71,38.46 11.73,30.48 10.82,30.48 U$1.18
  Bottom 0.152: R2.1 10.82,30.48 U$1.18 | v25.3,62.48 23.93,61.11 23.93,59.74 23.62,59.44 23.62,42.37 v19.71,38.46
MEM_A13  (via drill 0.35)
  Top 0.152: v69.65,51.51 69.65,40.39 69.34,40.08 69.34,36.88 v67.36,34.9 | v74.68,33.98 74.68,26.52 v74.22,26.06 | IC4.28 52.22,16.51 53.49,15.24 57.15,15.24 58.42,16.51 IC2.28
  Bottom 0.152: v69.65,51.51 69.8,51.66 69.8,65.53 73.61,69.34 73.61,69.8 IC3.15 | v67.36,34.9 73.76,34.9 v74.68,33.98 | v74.22,26.06 64.77,16.61 IC2.28
MEM_A14  (via drill 0.35)
  Top 0.152: v64.47,46.63 62.79,44.96 v62.79,32.16 | IC4.3 56.29,11.43 58.83,13.97 IC2.29
  Bottom 0.152: v64.47,46.63 64.77,46.94 64.77,63.09 71.02,69.34 71.02,69.8 IC3.16 | v62.79,32.16 63.09,32.46 63.55,32.46 63.86,32.77 76.5,32.77 78.79,30.48 81.23,30.48 81.99,29.72 81.99,26.21 81.23,25.45 77.11,25.45 65.68,14.02 64.77,14.02 IC2.29
MEM_A15
  Top 0.152: IC2.3 79.86,11.58 78.49,11.58 77.42,12.65 59.28,12.65 56.84,10.21 42.06,10.21 40.84,8.99 39.47,8.99 IC4.31
  Bottom 0.152: IC4.31 39.32,8.84 38.41,8.84 37.64,8.08 28.65,8.08 25.76,10.97 25.76,59.28 28.65,62.18 31.39,62.18 34.14,59.44 58.22,59.44 68.58,69.8 IC3.17
MEM_A16
  Top 0.152: 80.01,8.99 78.49,8.99 77.27,10.21 62.23,10.21 60.91,8.89 IC4.2 | 80.01,8.99 81.53,8.99 86.56,14.02 97.99,14.02 98.91,14.94 98.91,15.54 98.6,15.85 98.6,17.07 98.91,17.37 98.91,18.14 98.6,18.44 98.6,19.66 98.91,19.96 98.91,20.73 98.6,21.03 98.6,22.25 98.91,22.55 98.91,23.16 98.6,23.47 98.6,24.69 98.91,24.99 98.91,25.76 98.6,26.06 98.6,27.28 98.91,27.58 98.91,28.35 98.6,28.65 98.6,29.87 98.91,30.18 98.91,30.79 98.6,31.09 98.6,32.31 98.91,32.61 98.91,33.38 98.6,33.68 98.6,34.9 98.91,35.2 98.91,35.97 98.6,36.27 98.6,37.49 98.91,37.8 98.91,38.41 97.69,39.62 97.38,39.62 96.77,40.23 96.77,41.15 95.86,42.06 93.42,42.06 66.14,69.34 66.14,69.8 IC3.18 | 80.01,8.99 IC2.2
N$1
  Bottom 0.152: LED1.A 25.82,70.27 R10.1
N$5
  Bottom 0.152: U$1.2 13.08,58.8 15.24,60.96 Q1.2 C1.1
N$30
  Bottom 0.152: U$1.3 10.92,57.15 16.51,57.15 20.32,60.96 Q1.1 C2.1
NMI
  Top 0.152: EXT.4 97.69,38.1 96.47,39.32 96.01,39.32 95.71,39.62 94.49,39.62 94.34,39.47 94.03,39.47 64.77,68.73 64.77,71.02 63.7,72.08 12.95,72.08 8.84,67.97 8.84,49.38 10.06,48.16 10.67,48.16 U$1.8
  Bottom 0.152: R4.1 15.54,47.09 12.65,47.09 11.73,48.01 10.82,48.01 U$1.8
P20
  Top 0.152: U$1.9 10.67,46.48 10.21,46.48 6.25,50.44 4.42,50.44 4.27,50.6 4.12,50.6 3.96,50.75 2.59,50.75 GPIO.2
P21
  Top 0.152: U$1.10 10.67,44.65 9.91,44.65 6.71,47.85 4.42,47.85 4.12,48.16 2.59,48.16 GPIO.3
P22
  Top 0.152: GPIO.4 3.66,45.72 4.42,44.96 7.62,44.96 9.75,42.82 10.67,42.82 U$1.11
P23
  Top 0.152: U$1.12 10.67,41.15 10.21,41.15 8.53,42.82 4.42,42.82 4.27,42.98 4.12,42.98 3.96,43.13 2.59,43.13 GPIO.5
P24
  Top 0.152: U$1.13 10.67,39.32 9.91,39.32 8.99,40.23 4.42,40.23 4.12,40.54 2.59,40.54 GPIO.6
P25
  Top 0.152: GPIO.7 3.66,38.1 4.42,37.34 10.67,37.34 U$1.14
P26
  Top 0.152: U$1.15 10.67,35.81 4.12,35.81 3.96,35.66 2.59,35.66 GPIO.8
P27
  Top 0.152: U$1.16 10.67,33.83 9.91,33.83 9.3,33.22 4.12,33.22 3.96,33.07 2.59,33.07 GPIO.9
P52
  Top 0.152: GPIO.10 3.66,30.48 4.42,29.72 8.84,29.72 9.91,28.65 10.67,28.65 U$1.19
P53
  Top 0.152: U$1.20 10.67,26.82 9.75,26.82 8.99,27.58 4.42,27.58 4.27,27.74 4.12,27.74 3.96,27.89 2.59,27.89 GPIO.11
  Bottom 0.152: R9.1 14.26,26.8 U$1.20
P54
  Top 0.152: U$1.21 10.67,25.15 4.12,25.15 3.96,25.3 2.59,25.3 GPIO.12
P55
  Top 0.152: GPIO.13 3.66,22.86 4.72,23.93 9.3,23.93 9.91,23.32 10.67,23.32 U$1.22
P56
  Top 0.152: U$1.23 10.67,21.34 5.03,21.34 4.12,20.42 2.59,20.42 GPIO.14
P57
  Top 0.152: U$1.24 10.67,19.66 9.75,19.66 8.23,18.14 4.42,18.14 4.27,17.98 4.12,17.98 3.96,17.83 2.59,17.83 GPIO.15
PAGE_A13  (via drill 0.35)
  Top 0.152: v24.54,53.95 24.54,30.79 v14.02,20.27 11.73,17.98 10.82,17.98 U$1.25
  Bottom 0.152: v24.54,53.95 24.54,59.44 28.19,63.09 41.45,63.09 48.16,69.8 IC3.25 | R15.2 14.02,21.22 v14.02,20.27
PAGE_A14  (via drill 0.35)
  Top 0.152: v24.99,61.27 24.99,59.13 26.98,57.15 26.98,31.85 v14.07,18.95 11.28,16.15 10.82,16.15 U$1.26
  Bottom 0.152: v24.99,61.27 25.45,61.27 30.48,66.29 39.47,66.29 41.91,68.73 41.91,71.02 42.67,71.78 48.77,71.78 50.75,69.8 IC3.24 | R14.2 14.29,18.95 v14.07,18.95
PAGE_A15  (via drill 0.35)
  Top 0.152: v8.23,59.89 8.23,67.82 13.11,72.69 v56.08,72.69
  Bottom 0.152: v8.23,59.89 8.23,16.46 10.21,14.48 10.67,14.48 U$1.27 12.23,14.35 R13.2 | v56.08,72.69 58.37,70.41 58.37,69.95 IC3.21
PAGE_A16
  Bottom 0.152: 10.87,12.65 9.91,12.65 4.72,17.83 4.72,59.28 3.66,60.35 3.66,66.6 9.14,72.08 51.97,72.08 53.34,70.71 IC3.23 | R12.2 13.97,15.24 11.38,12.65 10.87,12.65 | U$1.28 10.87,12.65
PAGE_A17  (via drill 0.35)
  Top 0.152: v26.67,30.63 26.67,26.21 v14.2,13.74 11.28,10.82 10.82,10.82 U$1.29 | v38.1,55.47 39.01,55.47 40.08,56.54 41.15,56.54 43.13,54.56 IC3.2
  Bottom 0.152: v26.67,30.63 26.67,52.58 28.5,54.41 37.03,54.41 v38.1,55.47 | R11.2 14.62,13.74 v14.2,13.74
PAGE_FN1  (via drill 0.35)
  Top 0.152: v22.25,19.66 11.73,9.14 10.82,9.14 U$1.30
  Bottom 0.152: R8.1 15.54,10.21 12.8,10.21 11.73,9.14 10.82,9.14 U$1.30 | v22.25,19.66 23.93,21.34 23.93,59.28 28.04,63.4 39.27,63.4 IC3.26
PAGE_FN2  (via drill 0.35)
  Top 0.152: v32.61,62.48 36.27,62.48 43.13,69.34 43.13,69.8 IC3.27 | v19.71,15.44 11.58,7.32 10.82,7.32 U$1.31
  Bottom 0.152: R7.1 12.5,7.62 12.04,7.16 10.82,7.16 U$1.31 | v32.61,62.48 32.16,62.48 31.85,62.79 28.35,62.79 25.15,59.59 25.15,20.88 v19.71,15.44
PAGE_FN3  (via drill 0.35)
  Top 0.152: v31.7,60.96 37.95,54.71 40.54,54.71 IC3.1 | v26.98,58.06 26.98,57.61 27.28,57.3 27.28,21.18 11.58,5.49 10.82,5.49 U$1.32
  Bottom 0.152: R1.1 15.54,5.18 12.19,5.18 12.04,5.33 10.82,5.33 U$1.32 | v31.7,60.96 31.7,61.11 30.94,61.87 28.8,61.87 26.98,60.05 v26.98,58.06
RAMCS  (via drill 0.35)
  Top 0.152: v77.42,36.73 77.42,26.82 78.79,25.45 81.08,25.45 81.99,24.54 81.99,16 81.23,15.24 63.55,15.24 63.25,14.94 58.52,14.94 56.24,12.65 44.45,12.65 43.23,11.43 IC4.30 | v69.95,39.78 69.95,50.9 70.26,51.21 70.26,51.97 69.04,53.19 69.04,53.34 68.58,53.8 IC3.12
  Bottom 0.152: v77.42,36.73 73,36.73 v69.95,39.78
RD
  Top 0.152: IC2.24 64.77,26.82 62.79,28.8 62.79,30.63 55.32,38.1 53.49,38.1 45.57,46.02 44.45,46.02 31.67,58.8 U$1.63
  Bottom 0.152: IC4.24 40.23,26.67 46.63,20.27 57,20.27 63.25,26.52 64.62,26.52 IC2.24
RES
  Top 0.152: EXT.3 92.81,38.1 69.04,61.87 24.54,61.87 14.35,51.69 U$1.6
  Bottom 0.152: U$12.P$2 5.03,65.99 5.03,65.38 5.33,65.08 5.18,64.92 5.18,63.25 C3.1 5.18,63.09 5.94,63.09 8.84,60.2 8.84,52.88 9.91,51.82 10.67,51.82 U$1.6 10.82,51.82 12.04,51.82 12.34,52.12 15.54,52.12 R6.1
ROMCS
  Top 0.152: 70.56,43.13 70.56,53.19 71.02,53.65 71.02,54.56 IC3.13 | 70.56,43.13 70.56,37.19 65.23,31.85 64.77,31.85 IC2.22 | 70.56,43.13 81.23,43.13 92.66,31.7 96.47,31.7 97.69,30.48 EXT.10
RW  (via drill 0.35)
  Top 0.152: v31.85,56.69 31.85,56.39 30.79,55.32 29.87,55.32 U$1.61 | v73.46,45.87 81.23,45.87 93.88,33.22 93.88,32.46 94.34,32 96.77,32 EXT.8
  Bottom 0.152: v31.85,56.69 39.32,56.69 39.78,57.15 60.81,57.15 62.18,55.78 62.18,48.01 64.31,45.87 v73.46,45.87
STBY
  Bottom 0.152: R5.1 12.5,49.53 12.04,49.99 10.82,49.99 U$1.7
WR
  Top 0.152: U$1.62 29.72,57 28.8,57 27.89,56.08 27.89,15.85 28.5,15.24 31.45,15.24 31.75,14.94 37.95,14.94 38.86,14.02 39.32,14.02 IC4.29
  Bottom 0.152: IC2.31 64.77,8.99 63.25,8.99 62.03,10.21 44.04,10.21 41.1,13.16 40.39,13.87 39.47,13.87 IC4.29

### Text on the board
Top: PYLDIN-2018 / CPU-MEM v1.2 / z.pdaXrom.org
tPlace: POWER | RESET | ADDR / DECODER | GND | P20 | P21 | P22 | P23RX | P24TX | GND | GND | P25 | RES | NMI | P26 | IRQ1 | IRQ2 | P27 | E | RW | P52 | EXTCS | ROMCS | P53 | D1 | D0 | P54 | D3 | D2 | P55 | D5 | D4 | P56 | D7 | D6 | P57 | A1 | A0 | +5V | A3 | A2 | A5 | A4 | A7 | A6 | CPU | RAM | ROM | +5V | +5V